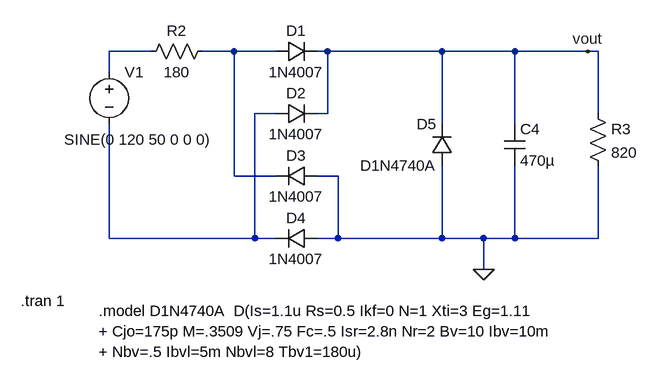
[diagram p0: schematic Capacitor-dropper-circuit-2.asc]
Capacitor-dropper-circuit-2.asc, the LTspice schematic file:
Version 4.1
SHEET 1 900 900
WIRE 128 64 64 64
WIRE 256 64 208 64
WIRE 320 64 256 64
WIRE 400 64 384 64
WIRE 576 64 400 64
WIRE 688 64 576 64
WIRE 800 64 688 64
WIRE 816 64 800 64
WIRE 64 96 64 64
WIRE 320 160 288 160
WIRE 400 160 400 64
WIRE 400 160 384 160
WIRE 816 160 816 64
WIRE 576 176 576 64
WIRE 688 176 688 64
WIRE 256 256 256 64
WIRE 320 256 256 256
WIRE 416 256 384 256
WIRE 64 352 64 176
WIRE 288 352 288 160
WIRE 288 352 64 352
WIRE 320 352 288 352
WIRE 416 352 416 256
WIRE 416 352 384 352
WIRE 576 352 576 240
WIRE 576 352 416 352
WIRE 640 352 576 352
WIRE 688 352 688 240
WIRE 688 352 640 352
WIRE 816 352 816 240
WIRE 816 352 688 352
WIRE 640 400 640 352
FLAG 800 64 vout
FLAG 640 400 0
SYMBOL voltage 64 80 R0
WINDOW 3 -69 120 Left 2
WINDOW 123 24 124 Left 2
WINDOW 39 0 0 Left 0
SYMATTR Value SINE(0 120 50 0 0 0)
SYMATTR InstName V1
SYMBOL res 112 80 R270
WINDOW 0 32 56 VTop 2
WINDOW 3 0 56 VBottom 2
SYMATTR InstName R2
SYMATTR Value 180
SYMBOL diode 320 80 R270
WINDOW 0 32 32 VTop 2
WINDOW 3 0 32 VBottom 2
SYMATTR InstName D1
SYMATTR Value 1N4007
SYMBOL diode 320 176 R270
WINDOW 0 32 32 VTop 2
WINDOW 3 0 32 VBottom 2
SYMATTR InstName D2
SYMATTR Value 1N4007
SYMBOL diode 384 240 R90
WINDOW 0 0 32 VBottom 2
WINDOW 3 32 32 VTop 2
SYMATTR InstName D3
SYMATTR Value 1N4007
SYMBOL diode 384 336 R90
WINDOW 0 0 32 VBottom 2
WINDOW 3 32 32 VTop 2
SYMATTR InstName D4
SYMATTR Value 1N4007
SYMBOL diode 592 240 R180
WINDOW 0 24 64 Left 2
WINDOW 3 24 0 Left 2
SYMATTR InstName D5
SYMATTR Value D1N4740A
SYMBOL res 800 144 R0
SYMATTR InstName R3
SYMATTR Value 820
SYMBOL cap 672 176 R0
SYMATTR InstName C4
SYMATTR Value 470µ
TEXT -72 448 Left 2 !.tran 1
TEXT 48 464 Left 2 !.model D1N4740A  D(Is=1.1u Rs=0.5 Ikf=0 N=1 Xti=3 Eg=1.11\n+ Cjo=175p M=.3509 Vj=.75 Fc=.5 Isr=2.8n Nr=2 Bv=10 Ibv=10m\n+ Nbv=.5 Ibvl=5m Nbvl=8 Tbv1=180u)

The netlist it stands for:
* Capacitor-dropper-circuit-2.asc
V1 N001 N003 SINE(0 120 50 0 0 0)
R2 N001 N002 180
D1 N002 vout 1N4007
D2 N003 vout 1N4007
D3 0 N002 1N4007
D4 0 N003 1N4007
D5 0 vout D1N4740A
R3 vout 0 820
C4 vout 0 470µ
.model D D
.lib standard.dio
.tran 1
.model D1N4740A  D(Is=1.1u Rs=0.5 Ikf=0 N=1 Xti=3 Eg=1.11
+ Cjo=175p M=.3509 Vj=.75 Fc=.5 Isr=2.8n Nr=2 Bv=10 Ibv=10m
+ Nbv=.5 Ibvl=5m Nbvl=8 Tbv1=180u)
.backanno
.end